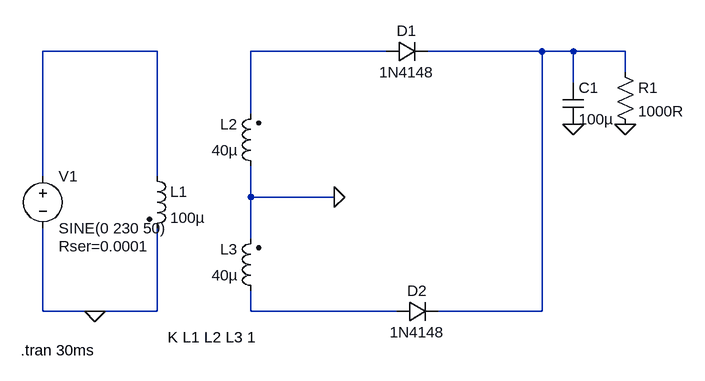
[diagram p0: schematic EXP-1_FullWaveRectifier.asc]
EXP-1_FullWaveRectifier.asc, the LTspice schematic file:
Version 4
SHEET 1 980 680
WIRE 160 -160 -16 -160
WIRE 512 -160 304 -160
WIRE 752 -160 576 -160
WIRE 800 -160 752 -160
WIRE 880 -160 800 -160
WIRE 880 -128 880 -160
WIRE 800 -112 800 -160
WIRE 304 -64 304 -160
WIRE -16 32 -16 -160
WIRE 160 32 160 -160
WIRE 304 64 304 16
WIRE 432 64 304 64
WIRE 304 128 304 64
WIRE -16 240 -16 112
WIRE 64 240 -16 240
WIRE 160 240 160 112
WIRE 160 240 64 240
WIRE 304 240 304 208
WIRE 528 240 304 240
WIRE 752 240 752 -160
WIRE 752 240 592 240
FLAG 880 -48 0
FLAG 432 64 0
FLAG 64 240 0
FLAG 800 -48 0
SYMBOL voltage -16 16 R0
WINDOW 123 0 0 Left 0
WINDOW 39 24 124 Left 2
SYMATTR InstName V1
SYMATTR Value SINE(0 230 50)
SYMATTR SpiceLine Rser=0.0001
SYMBOL ind2 144 16 R0
SYMATTR InstName L1
SYMATTR Value 100µ
SYMATTR Type ind
SYMBOL diode 512 -144 R270
WINDOW 0 32 32 VTop 2
WINDOW 3 0 32 VBottom 2
SYMATTR InstName D1
SYMATTR Value 1N4148
SYMBOL diode 528 256 R270
WINDOW 0 32 32 VTop 2
WINDOW 3 0 32 VBottom 2
SYMATTR InstName D2
SYMATTR Value 1N4148
SYMBOL res 864 -144 R0
SYMATTR InstName R1
SYMATTR Value 1000R
SYMBOL ind2 320 32 R180
WINDOW 0 36 80 Left 2
WINDOW 3 36 40 Left 2
SYMATTR InstName L2
SYMATTR Value 40µ
SYMATTR Type ind
SYMBOL ind2 320 224 R180
WINDOW 0 36 80 Left 2
WINDOW 3 36 40 Left 2
SYMATTR InstName L3
SYMATTR Value 40µ
SYMATTR Type ind
SYMBOL cap 784 -112 R0
SYMATTR InstName C1
SYMATTR Value 100µ
TEXT 176 280 Left 2 !K L1 L2 L3 1
TEXT -50 300 Left 2 !.tran 30ms

The netlist it stands for:
* EXP-1_FullWaveRectifier.asc
V1 N001 0 SINE(0 230 50) Rser=0.0001
L1 N001 0 100µ
D1 N002 N003 1N4148
D2 N004 N003 1N4148
R1 N003 0 1000R
L2 0 N002 40µ
L3 N004 0 40µ
C1 N003 0 100µ
.model D D
.lib standard.dio
K L1 L2 L3 1
.tran 30ms
.backanno
.end